# Altium project BTL_SCT.PrjPcb
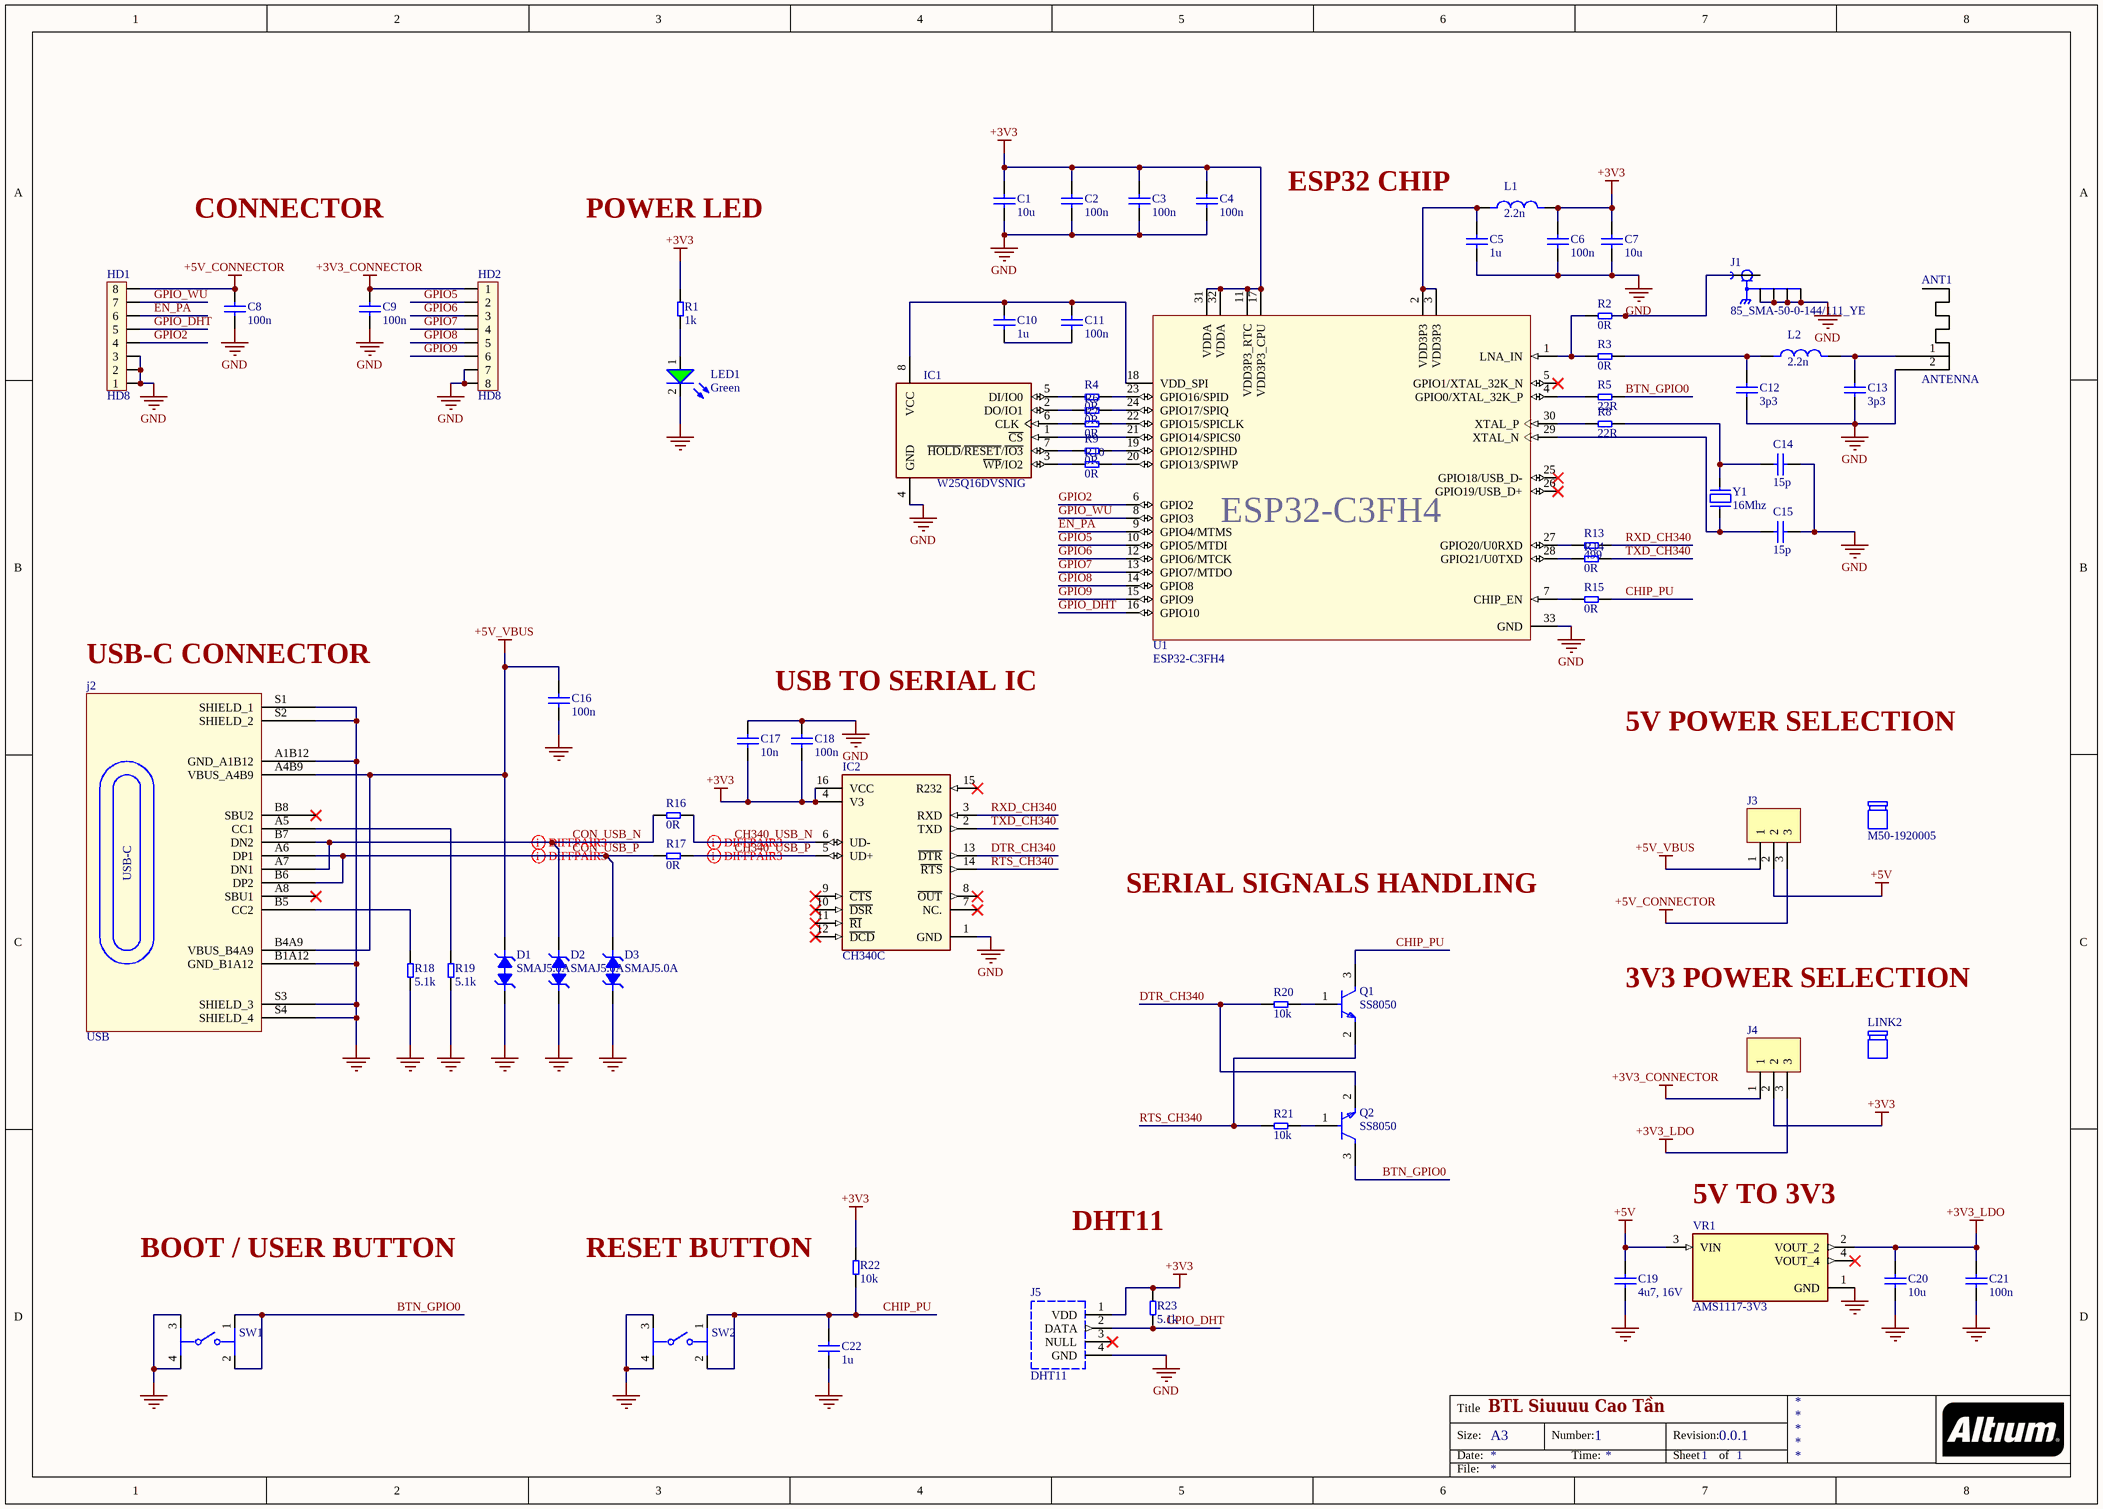
[diagram p0: Main.SchDoc]
1 sheet, 68 parts. Net scope: global (net labels, ports and power ports of the same name join across sheets).
Board file: [2] Main.PcbDoc

## Sheet Main.SchDoc: BTL Siuuuu Cao Tần
size A3; Author: Lý Đoàn Dự; DocumentNumber: 1; Revision: 0.0.1; SheetNumber: 1; SheetTotal: 1

### Parts
ANT1  ANTENNA  [ANT_IFA_USB_2_4GHZ_50R]
C1  10u  [1206_CAP]
C2  100n  [1206_CAP]
C3  100n  [1206_CAP]
C4  100n  [1206_CAP]
C5  1u  [1206_CAP]
C6  100n  [1206_CAP]
C7  10u  [1206_CAP]
C8  100n  [1206_CAP]
C9  100n  [1206_CAP]
C10  1u  [1206_CAP]
C11  100n  [1206_CAP]
C12  3p3  [0805_CAP]
C13  3p3  [0805_CAP]
C14  15p  [0805_CAP]
C15  15p  [0805_CAP]
C16  100n  [1206_CAP]
C17  10n  [1206_CAP]
C18  100n  [1206_CAP]
C19  4u7, 16V  [1206_CAP]
C20  10u  [1206_CAP]
C21  100n  [1206_CAP]
C22  1u  [1206_CAP]
D1  SMAJ5.0A  [SMAJ5.0A]
D2  SMAJ5.0A  [SMAJ5.0A]
D3  SMAJ5.0A  [SMAJ5.0A]
HD1  HD8  [Header_8]
HD2  HD8  [Header_8]
IC1  W25Q16DVSNIG  [W25Q16DVSNIG]
IC2  CH340C  [CH340C]
J1  85_SMA-50-0-144/111_YE  [SMA]
j2  USB  [USB]
J3  FTS-103-01-F-S  [Header_3]  (value not drawn)
J4  FTS-103-01-F-S  [Header_3]  (value not drawn)
J5  DHT11  [DHT11]
L1  2.2n  [0805_INDUCTOR]
L2  2.2n  [0805_INDUCTOR]
LED1  value Green  [Led 0805G]  (hidden comment: LED-0805GVC)
LINK1  M50-1920005  (mechanical)
LINK2  M50-1920005  (value not drawn)  (mechanical)
Q1  SS8050  [SS8050]
Q2  SS8050  [SS8050]
R1  1k  [RES_0R0_1206]
R2  0R  [RES_0R0_1206]
R3  0R  [RES_0R0_1206]
R4  0R  [RES_0R0_1206]
R5  22R  [RES_0R0_1206]
R6  0R  [RES_0R0_1206]
R7  0R  [RES_0R0_1206]
R8  22R  [RES_0R0_1206]
R9  0R  [RES_0R0_1206]
R10  0R  [RES_0R0_1206]
R13  499  [RES_0R0_1206]
R14  0R  [RES_0R0_1206]
R15  0R  [RES_0R0_1206]
R16  0R  [RES_0R0_1206]
R17  0R  [RES_0R0_1206]
R18  5.1k  [RES_0R0_1206]
R19  5.1k  [RES_0R0_1206]
R20  10k  [RES_0R0_1206]
R21  10k  [RES_0R0_1206]
R22  10k  [RES_0R0_1206]
R23  5.1k  [RES_0R0_1206]
SW1  (no value)  [Nut nhan 4 chan]
SW2  (no value)  [Nut nhan 4 chan]
U1  ESP32-C3FH4  [QFN50P500X500X90-33N]
VR1  AMS1117-3V3  [LM1117 3V3]
Y1  16Mhz  [Thach Anh 2 chan cam]

### Nets
+3V3: C1.2 C2.2 C3.2 C4.2 C6.2 C7.2 C17.2 C18.2 IC2.4(V3) IC2.16(VCC) J4.2 J5.1(VDD) L1.2 R1.2 R22.1 R23.2 U1.11(VDD3P3_RTC) U1.17(VDD3P3_CPU) U1.31(VDDA) U1.32(VDDA)
+3V3_CONNECTOR: C9.1 HD2.1 J4.1
+3V3_LDO: C20.2 C21.2 J4.3 VR1.2(VOUT_2)
+5V: C19.2 J3.2 VR1.3(VIN)
+5V_CONNECTOR: C8.1 HD1.8 J3.3
+5V_VBUS: C16.1 D1.2 j2.A4B9(VBUS_A4B9) j2.B4A9(VBUS_B4A9) J3.1
GND: ANT1.2 C1.1 C2.1 C3.1 C4.1 C5.1 C6.1 C7.1 C8.2 C9.2 C12.1 C13.1 C14.1 C15.1 C16.2 C17.1 C18.1 C19.1 C20.1 C21.1 C22.2 D1.1 D2.1 D3.1 HD1.1 HD1.2 HD1.3 HD2.7 HD2.8 IC1.4(GND) IC2.1(GND) J1.G1 J1.G2 J1.G3 J1.G4 j2.A1B12(GND_A1B12) j2.B1A12(GND_B1A12) j2.S1(SHIELD_1) j2.S2(SHIELD_2) j2.S3(SHIELD_3) j2.S4(SHIELD_4) J5.4(GND) LED1.2(K) R18.1 R19.1 SW1.3 SW1.4 SW2.3 SW2.4 U1.33(GND) VR1.1(GND)
BTN_GPIO0: Q2.3(C) R5.2 SW1.1 SW1.2
CH340_USB_N: IC2.6(UD-) R16.1
CH340_USB_P: IC2.5(UD+) R17.1
CHIP_PU: C22.1 Q1.3(C) R15.2 R22.2 SW2.1 SW2.2
CON_USB_N: D2.2 j2.A7(DN1) j2.B7(DN2) R16.2
CON_USB_P: D3.2 j2.A6(DP1) j2.B6(DP2) R17.2
DTR_CH340: IC2.13(~{DTR}) Q2.2(E) R20.2
EN_PA: HD1.6 U1.9(GPIO4/MTMS)
GPIO2: HD1.4 U1.6(GPIO2)
GPIO5: HD2.2 U1.10(GPIO5/MTDI)
GPIO6: HD2.3 U1.12(GPIO6/MTCK)
GPIO7: HD2.4 U1.13(GPIO7/MTDO)
GPIO8: HD2.5 U1.14(GPIO8)
GPIO9: HD2.6 U1.15(GPIO9)
GPIO_DHT: HD1.5 J5.2(DATA) R23.1 U1.16(GPIO10)
GPIO_WU: HD1.7 U1.8(GPIO3)
RTS_CH340: IC2.14(~{RTS}) Q1.2(E) R21.2
RXD_CH340: IC2.3(RXD) R13.2
TXD_CH340: IC2.2(TXD) R14.2
NetANT1_1: ANT1.1 C13.2 L2.2
NetC5_2: C5.2 L1.1 U1.2(VDD3P3) U1.3(VDD3P3)
NetC10_1: C10.1 C11.1
NetC10_2: C10.2 C11.2 IC1.8(VCC) U1.18(VDD_SPI)
NetC12_2: C12.2 L2.1 R3.2
NetC14_2: C14.2 R8.2 Y1.2
NetC15_2: C15.2 U1.29(XTAL_N) Y1.1
NetIC1_1: IC1.1(~{CS}) U1.21(GPIO14/SPICS0)
NetIC1_2: IC1.2(DO/IO1) R6.1
NetIC1_3: IC1.3(~{WP}/IO2) R10.1
NetIC1_5: IC1.5(DI/IO0) R4.1
NetIC1_6: IC1.6(CLK) R7.1
NetIC1_7: IC1.7(~{HOLD}/~{RESET}/~{IO3}) R9.1
NetJ1_1: J1.1 R2.2
Netj2_A5: j2.A5(CC1) R19.2
Netj2_B5: j2.B5(CC2) R18.2
NetLED1_1: LED1.1(A) R1.1
NetQ1_1: Q1.1(B) R20.1
NetQ2_1: Q2.1(B) R21.1
NetR2_1: R2.1 R3.1 U1.1(LNA_IN)
NetR4_2: R4.2 U1.23(GPIO16/SPID)
NetR5_1: R5.1 U1.4(GPIO0/XTAL_32K_P)
NetR6_2: R6.2 U1.24(GPIO17/SPIQ)
NetR7_2: R7.2 U1.22(GPIO15/SPICLK)
NetR8_1: R8.1 U1.30(XTAL_P)
NetR9_2: R9.2 U1.19(GPIO12/SPIHD)
NetR10_2: R10.2 U1.20(GPIO13/SPIWP)
NetR13_1: R13.1 U1.27(GPIO20/U0RXD)
NetR14_1: R14.1 U1.28(GPIO21/U0TXD)
NetR15_1: R15.1 U1.7(CHIP_EN)

Not connected (* = marked no-connect by the designer): IC2 7(NC.)* 8(~{OUT})* 9(~{CTS})* 10(~{DSR})* 11(~{RI})* 12(~{DCD})* 15(R232)*; j2 A8(SBU1)* B8(SBU2)*; J5 3(NULL)*; U1 5(GPIO1/XTAL_32K_N)* 25(GPIO18/USB_D-)* 26(GPIO19/USB_D+)*; VR1 4(VOUT_4)*

### Layout directives
differential pair; differential pair class DIFF90: CH340_USB_N, CH340_USB_P, CON_USB_N, CON_USB_P

### Notes on the sheet
- ESP32 CHIP
- CONNECTOR
- POWER LED
- (near j2) USB-C CONNECTOR
- USB TO SERIAL IC
- 5V POWER SELECTION
- SERIAL SIGNALS HANDLING
- (near LINK2) 3V3 POWER SELECTION
- (near VR1) 5V TO 3V3
- BOOT / USER BUTTON
- RESET BUTTON
- DHT11
- Title
- Size:
- Date:
- A3
- Number:
- Time:
- Revision:
- Sheet
- of
- File:
- (in symbol USB) USB-C

### Library data of the parts
C1-C11 C16-C18 C20-C22 = CAP_1206
C12-C15 = CAP_0805
C19 = CL05A475MO5NUNC: CAP CER 4.7UF 16V X5R 0402; Manufacturer: Samsung; Dielectric Material: Ceramic; Multilayer: Yes; Tolerance  (fill in as +-): 20%; Supplier: Digikey; Supplier Part Number: 1276-6836-1-ND; Manufacturer Part Number: CL05A475MO5NUNC; RoHS: Yes; Category: Ceramic Capacitors; Stock: 647617; Pricing: 1=0.44, 10=0.293, 50=0.216, 100=0.1759, 500=0.13888, 1000=0.11727, 2500=0.1111, 5000=0.10493 (USD); Mounting Technology: Surface Mount; Pins: 2; Package Shape: Rectangular; Case/Package: 0402; Terminal Finish: Nickel; Min Operating Temperature: -55°C; Max Operating Temperature: 85°C; JESD-609 Code: e3; Value: 4.7uF; Capacitor Type: Ceramic; Package Style: SMTMeter; Packaging: Tape and Reel; Tolerance (fill in as +-): 20%; Rated DC Voltage (URdc): 16V; Temperature Characteristics Code: X5R; Termination: Wraparound; Length: 1mm; Width: 0.5mm; Height: 0.7mm; Reach SVHC Compliant: Yes; RoHS Compliant: Yes; ComponentLink1URL: https://datasheet.ciiva.com:443/pdfs/VipMasterIC/IC/SEMS/SEMS-S-A0008384515/SEMS-S-A0008898881-1.pdf?src-supplier=IHS+Markit; ComponentLink1Description: https://datasheet.ciiva.com:443/pdfs/VipMasterIC/IC/SEMS/SEMS-S-A0008384515/SEMS-S-A0008898881-1.pdf?src-supplier=IHS+Markit; ComponentLink2URL: http://www.farnell.com/datasheets/2710653.pdf?src-supplier=Farnell; ComponentLink2Description: http://www.farnell.com/datasheets/2710653.pdf?src-supplier=Farnell; ComponentLink3URL: http://www.samsungsem.com/kr/support/product-search/mlcc/CL05A475MO5NUNC.jsp?src-supplier=Digikey; ComponentLink3Description: http://www.samsungsem.com/kr/support/product-search/mlcc/CL05A475MO5NUNC.jsp?src-supplier=Digikey; ComponentLink4URL: http://www.farnell.com/datasheets/2710653.pdf?src-supplier=Newark; ComponentLink4Description: http://www.farnell.com/datasheets/2710653.pdf?src-supplier=Newark; ComponentLink5URL: http://www.farnell.com/datasheets/2710653.pdf?src-supplier=Element14; ComponentLink5Description: http://www.farnell.com/datasheets/2710653.pdf?src-supplier=Element14; ComponentLink6URL: https://datasheet.octopart.com/CL05A475MO5NUNC-Samsung-Electro-Mechanics-datasheet-123102911.pdf?src-supplier=Future+Electronics; ComponentLink6Description: https://datasheet.octopart.com/CL05A475MO5NUNC-Samsung-Electro-Mechanics-datasheet-123102911.pdf?src-supplier=Future+Electronics; LCSC Part Number: C318563
D1 D2 = AQ3045-01ETG: TVS DIODE 5.3VWM 12VC SOD882; Manufacturer: Littelfuse; Diode Element Material: SILICON; Package Body Material: Plastic; Polarity: Bidirectional; Max Breakdown Voltage: 9V; Min Breakdown Voltage: 6.8V; Diode Type: TRANS VOLTAGE SUPPRESSOR; Non-rep Peak Rev Power Dis-Max: 40W; Number of Elements: 1; Rep Pk Reverse Voltage-Max: 5.3V; Reference Standard: AEC-Q101; Supplier: Digikey; Supplier Part Number: F9321CT-ND; Manufacturer Part Number: AQ3045-01ETG; RoHS: Yes; Category: TVS Diodes; Stock: 21664; Pricing: 1=0.5, 10=0.391, 100=0.2344, 500=0.217, 1000=0.14756, 2000=0.13585, 5000=0.1302 (USD); Pins: 2; Package Shape: Rectangular; Min Operating Temperature: -55°C; Max Operating Temperature: 150°C; Package Style: CHIP CARRIERMeter; Surface Mount: Yes; Technology: AVALANCHE; Terminal Form: No Lead; Terminal Position: BOTTOM; Reach SVHC Compliant: Yes; RoHS Compliant: Yes; ComponentLink1URL: https://datasheet.ciiva.com:443/pdfs/VipMasterIC/IC/LFSI/LFSI-S-A0007892042/LFSI-S-A0007892042-1.pdf?src-supplier=IHS+Markit; ComponentLink1Description: https://datasheet.ciiva.com:443/pdfs/VipMasterIC/IC/LFSI/LFSI-S-A0007892042/LFSI-S-A0007892042-1.pdf?src-supplier=IHS+Markit; ComponentLink2URL: https://www.littelfuse.com/~/media/electronics/datasheets/tvs_diode_arrays/littelfuse_tvs_diode_array_aq3045_datasheet.pdf.pdf?src-supplier=Digikey; ComponentLink2Description: https://www.littelfuse.com/~/media/electronics/datasheets/tvs_diode_arrays/littelfuse_tvs_diode_array_aq3045_datasheet.pdf.pdf?src-supplier=Digikey; ComponentLink3URL: http://www.littelfuse.com/~/media/electronics/datasheets/tvs_diode_arrays/littelfuse_tvs_diode_array_aq3045_datasheet.pdf.pdf?src-supplier=Digikey; ComponentLink3Description: http://www.littelfuse.com/~/media/electronics/datasheets/tvs_diode_arrays/littelfuse_tvs_diode_array_aq3045_datasheet.pdf.pdf?src-supplier=Digikey; LCSC Part Number: C3710326
D3 = AQ3045-01ETG: TVS DIODE; Manufacturer: Littelfuse; Diode Element Material: SILICON; Package Body Material: Plastic; Polarity: Bidirectional; Max Breakdown Voltage: 9V; Min Breakdown Voltage: 6.8V; Diode Type: TRANS VOLTAGE SUPPRESSOR; Non-rep Peak Rev Power Dis-Max: 40W; Number of Elements: 1; Rep Pk Reverse Voltage-Max: 5.3V; Reference Standard: AEC-Q101; Supplier: Digikey; Supplier Part Number: F9321CT-ND; Manufacturer Part Number: AQ3045-01ETG; RoHS: Yes; Category: TVS Diodes; Stock: 21664; Pricing: 1=0.5, 10=0.391, 100=0.2344, 500=0.217, 1000=0.14756, 2000=0.13585, 5000=0.1302 (USD); Pins: 2; Package Shape: Rectangular; Min Operating Temperature: -55°C; Max Operating Temperature: 150°C; Package Style: CHIP CARRIERMeter; Surface Mount: Yes; Technology: AVALANCHE; Terminal Form: No Lead; Terminal Position: BOTTOM; Reach SVHC Compliant: Yes; RoHS Compliant: Yes; ComponentLink1URL: https://datasheet.ciiva.com:443/pdfs/VipMasterIC/IC/LFSI/LFSI-S-A0007892042/LFSI-S-A0007892042-1.pdf?src-supplier=IHS+Markit; ComponentLink1Description: https://datasheet.ciiva.com:443/pdfs/VipMasterIC/IC/LFSI/LFSI-S-A0007892042/LFSI-S-A0007892042-1.pdf?src-supplier=IHS+Markit; ComponentLink2URL: https://www.littelfuse.com/~/media/electronics/datasheets/tvs_diode_arrays/littelfuse_tvs_diode_array_aq3045_datasheet.pdf.pdf?src-supplier=Digikey; ComponentLink2Description: https://www.littelfuse.com/~/media/electronics/datasheets/tvs_diode_arrays/littelfuse_tvs_diode_array_aq3045_datasheet.pdf.pdf?src-supplier=Digikey; ComponentLink3URL: http://www.littelfuse.com/~/media/electronics/datasheets/tvs_diode_arrays/littelfuse_tvs_diode_array_aq3045_datasheet.pdf.pdf?src-supplier=Digikey; ComponentLink3Description: http://www.littelfuse.com/~/media/electronics/datasheets/tvs_diode_arrays/littelfuse_tvs_diode_array_aq3045_datasheet.pdf.pdf?src-supplier=Digikey; LCSC Part Number: C3710326
HD1 HD2 = Header8: Header 8; Creat by: VanDungEvn@Gmail.com
J1 = 85_SMA-50-0-144/111_YE: RF Connectors / Coaxial Connectors, Right Angle Pcb Jack | HUBER+SUHNER 85_SMA-50-0-144/111_YE; SnapEDA_Link: https://www.snapeda.com/parts/85_SMA-50-0-144/111_YE/Huber%252BSuhner/view-part/?ref=snap; Package: None; Value: *; MF: HUBER+SUHNER; MP: 85_SMA-50-0-144/111_YE; Check_prices: https://www.snapeda.com/parts/85_SMA-50-0-144/111_YE/Huber%252BSuhner/view-part/?ref=eda
J3 J4 = FTS-103-01-F-S: CONN HEADER VERT 3POS 1.27MM; Manufacturer: Samtec; Manufacturer Series: FTS; Connector Type: BOARD CONNECTOR; Option: General Purpose; Additional Feature: Low Profile; Filter Feature: No; Number of Rows Loaded: 1; Number of Contacts: 3; Supplier: Digikey; Supplier Part Number: 612-FTS-103-01-F-S-ND; Manufacturer Part Number: FTS-103-01-F-S; RoHS: Yes; Category: Connectors; Stock: 3910; Pricing: 1=1.2, 10=1.015, 100=0.911, 1000=0.66256, 5000=0.57974, 10000=0.55075 (USD); Mounting Technology: Board; Contact Material: Bronze; Contact Finish - Mating: GOLD (3) OVER NICKEL (50); Contact Finish - Termination: Matte Tin (Sn) - with Nickel (Ni) barrier; JESD-609 Code: e3; Contact Gender: Male; Mixed Contacts: No; Mounting Style: STRAIGHT; Termination: Solder; Terminal Pitch: 1.27mm; Flammability Rating: UL94 V-0; DIN Conformance: No; IEC Conformance: No; MIL Conformance: No; Reach SVHC Compliant: Yes; RoHS Compliant: Yes; ComponentLink1URL: https://datasheet.ciiva.com:443/pdfs/VipMasterIC/IC/SAMI/SAMI-S-A0001504673/SAMI-S-A0001504673-1.pdf?src-supplier=IHS+Markit; ComponentLink1Description: https://datasheet.ciiva.com:443/pdfs/VipMasterIC/IC/SAMI/SAMI-S-A0001504673/SAMI-S-A0001504673-1.pdf?src-supplier=IHS+Markit; ComponentLink2URL: http://suddendocs.samtec.com/prints/fts-1xx-xx-xx-xx-xx-mkt.pdf?src-supplier=Digikey; ComponentLink2Description: http://suddendocs.samtec.com/prints/fts-1xx-xx-xx-xx-xx-mkt.pdf?src-supplier=Digikey; ComponentLink3URL: http://www.samtec.com/documents/webfiles/pdf/FTS.pdf?src-supplier=Avnet; ComponentLink3Description: http://www.samtec.com/documents/webfiles/pdf/FTS.pdf?src-supplier=Avnet; ComponentLink4URL: https://datasheet.octopart.com/FTS-103-01-F-S-Samtec-datasheet-116535195.pdf?src-supplier=Toby+Electronics; ComponentLink4Description: https://datasheet.octopart.com/FTS-103-01-F-S-Samtec-datasheet-116535195.pdf?src-supplier=Toby+Electronics; ComponentLink5URL: https://datasheet.octopart.com/FTS-103-01-F-S-Samtec-datasheet-151470456.pdf?src-supplier=Sager+Electronics; ComponentLink5Description: https://datasheet.octopart.com/FTS-103-01-F-S-Samtec-datasheet-151470456.pdf?src-supplier=Sager+Electronics; LCSC Part Number: C3333578
J5 = DHT22: Capacitive-type humidity and temperature module/sensor; MF: Aosong Electronics; SnapEDA_Link: https://www.snapeda.com/parts/DHT22/Aosong+Electronics/view-part/?ref=snap; Package: Package; Value: *; MP: DHT22; Check_prices: https://www.snapeda.com/parts/DHT22/Aosong+Electronics/view-part/?ref=eda
L1 L2 = Inductor_0805: MF: Abracon; MP: ASMPH-0805-1R0M-T; SnapEDA_Link: https://www.snapeda.com/parts/ASMPH-0805-1R0M-T/Abracon/view-part/?ref=snap; Package: Package; Value: *; Check_prices: https://www.snapeda.com/parts/ASMPH-0805-1R0M-T/Abracon/view-part/?ref=eda
LED1 = LED-0805GVC: LED Green 2mA 3V 0805; ComponentLink1Description: Datasheet; ComponentLink1URL: D:\Dropbox\Datasheets\Opto and Illumination\LEDs\SMD LED.pdf; Unit Price: 0.0476
LINK1 LINK2 = M50-1920005: CONN SHUNT 1.27MM RED; Manufacturer: Harwin; Manufacturer Series: M50; Connector Type: Interconnection Device; Body/Shell Style: PLUG; Contact Pattern: RECTANGULAR; Contact Resistance: 20mR; Durability: 300Cycles; Insulation Resistance: 1GR; Number Of Connectors: 1; Rated Current (Signal): 1A; Number of Contacts: 2; Dielectric Withstanding Voltage (AC): 500V; Body Breadth: 0.059inch; Body Length: 0.098inch; Mating Contact Pitch: 0.05inch; Body Depth: 0.118inch; Reference Standard: UL; Reliability: COMMERCIAL; Supplier: Digikey; Supplier Part Number: 952-1727-ND; Manufacturer Part Number: M50-1920005; RoHS: Yes; Category: Headers and Wire Housings; Stock: 4401; Pricing: 1=0.43, 10=0.363, 25=0.3196, 50=0.2936, 100=0.2821, 250=0.25332, 500=0.2418, 1000=0.2015, 2500=0.18422 (USD); Contact Finish - Mating: AU ON NI; Contact Finish - Termination: Gold (Au); Insulation Color: Red; Insulation Material: Nylon; Contact Material: Copper Alloy; Min Operating Temperature: -40°C; Max Operating Temperature: 105°C; JESD-609 Code: e4; Contact Gender: Female; Mounting Style: STRAIGHT; Number of Rows Loaded: 1; Reach SVHC Compliant: Yes; RoHS Compliant: Yes; ComponentLink1URL: https://datasheet.ciiva.com:443/pdfs/VipMasterIC/IC/HRWN/HRWNS04645/HRWNS04645-1.pdf?src-supplier=IHS+Markit; ComponentLink1Description: https://datasheet.ciiva.com:443/pdfs/VipMasterIC/IC/HRWN/HRWNS04645/HRWNS04645-1.pdf?src-supplier=IHS+Markit; ComponentLink2URL: https://datasheet.ciiva.com/4573/m50-19x-350826-4573042.pdf?src-supplier=Mouser; ComponentLink2Description: https://datasheet.ciiva.com/4573/m50-19x-350826-4573042.pdf?src-supplier=Mouser; ComponentLink3URL: https://datasheet.ciiva.com/1412/1836978-1412125.pdf?src-supplier=Element14; ComponentLink3Description: https://datasheet.ciiva.com/1412/1836978-1412125.pdf?src-supplier=Element14; ComponentLink4URL: https://datasheet.ciiva.com/767/m50-19x-767921.pdf?src-supplier=Digikey; ComponentLink4Description: https://datasheet.ciiva.com/767/m50-19x-767921.pdf?src-supplier=Digikey; ComponentLink5URL: https://datasheet.ciiva.com/1456/m50-19x-1456640.pdf?src-supplier=Newark; ComponentLink5Description: https://datasheet.ciiva.com/1456/m50-19x-1456640.pdf?src-supplier=Newark; LCSC Part Number: C6985646
Q1 Q2 = SS8050-G: TRANS NPN 25V 1.5A SOT23-3; Manufacturer: Comchip; Supplier: Digikey; Supplier Part Number: 641-1790-1-ND; Manufacturer Part Number: SS8050-G; RoHS: Yes; Category: Transistors; Stock: 108568; Pricing: 1=0.29, 10=0.2, 100=0.0978, 500=0.08154, 1000=0.05666 (USD); Reach SVHC Compliant: Yes; RoHS Compliant: Yes; ComponentLink1URL: https://datasheet.ciiva.com:443/pdfs/VipMasterIC/IC/COMC/COMC-S-A0004994192/COMC-S-A0004994192-1.pdf?src-supplier=IHS+Markit; ComponentLink1Description: https://datasheet.ciiva.com:443/pdfs/VipMasterIC/IC/COMC/COMC-S-A0004994192/COMC-S-A0004994192-1.pdf?src-supplier=IHS+Markit; ComponentLink2URL: http://www.comchiptech.com/admin/files/product/SS8050-G RevA181526.pdf?src-supplier=Digikey; ComponentLink2Description: http://www.comchiptech.com/admin/files/product/SS8050-G RevA181526.pdf?src-supplier=Digikey; LCSC Part Number: C164886
R1-R10 R13-R23 = RES_1206
SW1 SW2 = PTS645SH50SMTR92LFS: SWITCH TACTILE SPST-NO 0.05A 12V; Manufacturer: ITT C&K; Manufacturer Series: PTS645; Actuator Type: Pushbutton; Contact Current(DC)-Max: 50mA; Contact DC Max Rating R Load: 0.05A@12VDC; Contact Resistance: 0.1mR; Dielectric Withstand Volts: 250VACV; Electrical Life: 100000Cycles; Insulation Resistance: 100GR; PCB Hole Count: 4; Switch Action: MOMENTARY; Switch Function: SPST; Switch Type: Keypad; Body Breadth: 5.9944inch; Body Height: 3.4544mm; Body Length or Diameter: 5.9944mm; Supplier: Digikey; Supplier Part Number: CKN9085CT-ND; Manufacturer Part Number: PTS645SH50SMTR92LFS; RoHS: Yes; Category: Tactile Switches; Stock: 64637; Pricing: 1=0.35, 10=0.337, 25=0.3172, 100=0.2753, 250=0.24972, 500=0.2323 (USD); Mounting Technology: Surface Mount; Terminal Finish: Silver; Min Operating Temperature: -20°C; Max Operating Temperature: 60°C; JESD-609 Code: e4; Contact Voltage(DC)-Max: 12V; Termination: Solder; Terminal Length: 0.138inch; Reach SVHC Compliant: Yes; RoHS Compliant: Yes; ComponentLink1URL: https://datasheet.ciiva.com:443/pdfs/VipMasterIC/IC/CKCI/CKCI-S-A0001796527/CKCI-S-A0001796842-1.pdf?src-supplier=IHS+Markit; ComponentLink1Description: https://datasheet.ciiva.com:443/pdfs/VipMasterIC/IC/CKCI/CKCI-S-A0001796527/CKCI-S-A0001796842-1.pdf?src-supplier=IHS+Markit; ComponentLink2URL: https://datasheet.ciiva.com/29903/getdatasheetpartid-773702-29903807.pdf?src-supplier=Verical; ComponentLink2Description: https://datasheet.ciiva.com/29903/getdatasheetpartid-773702-29903807.pdf?src-supplier=Verical; ComponentLink3URL: https://datasheet.ciiva.com/14920/pts645-14920741.pdf?src-supplier=Digikey; ComponentLink3Description: https://datasheet.ciiva.com/14920/pts645-14920741.pdf?src-supplier=Digikey; ComponentLink4URL: https://datasheet.ciiva.com/22637/1707731-22637356.pdf?src-supplier=Element14; ComponentLink4Description: https://datasheet.ciiva.com/22637/1707731-22637356.pdf?src-supplier=Element14; LCSC Part Number: C221869
VR1 = LM1117IMP-3.3/NOPB: linear voltage regulator; MF: Texas Instruments; SnapEDA_Link: https://www.snapeda.com/parts/LM1117IMP-3.3/NOPB/Texas+Instruments/view-part/?ref=snap; Package: SOT-223-4 Texas Instruments; Value: *; MP: LM1117IMP-3.3/NOPB; Check_prices: https://www.snapeda.com/parts/LM1117IMP-3.3/NOPB/Texas+Instruments/view-part/?ref=eda
Y1 = Thach Anh 2 chan Cam: Crystal For all Crystal 2pin.; Value: 4Mhz
U1 = ESP32-C3FH4: Package: None; Price: None; Value: *; MP: ESP32-C3FH4; Availability: Unavailable